# Altium project EndNodeSmall.PrjPcb
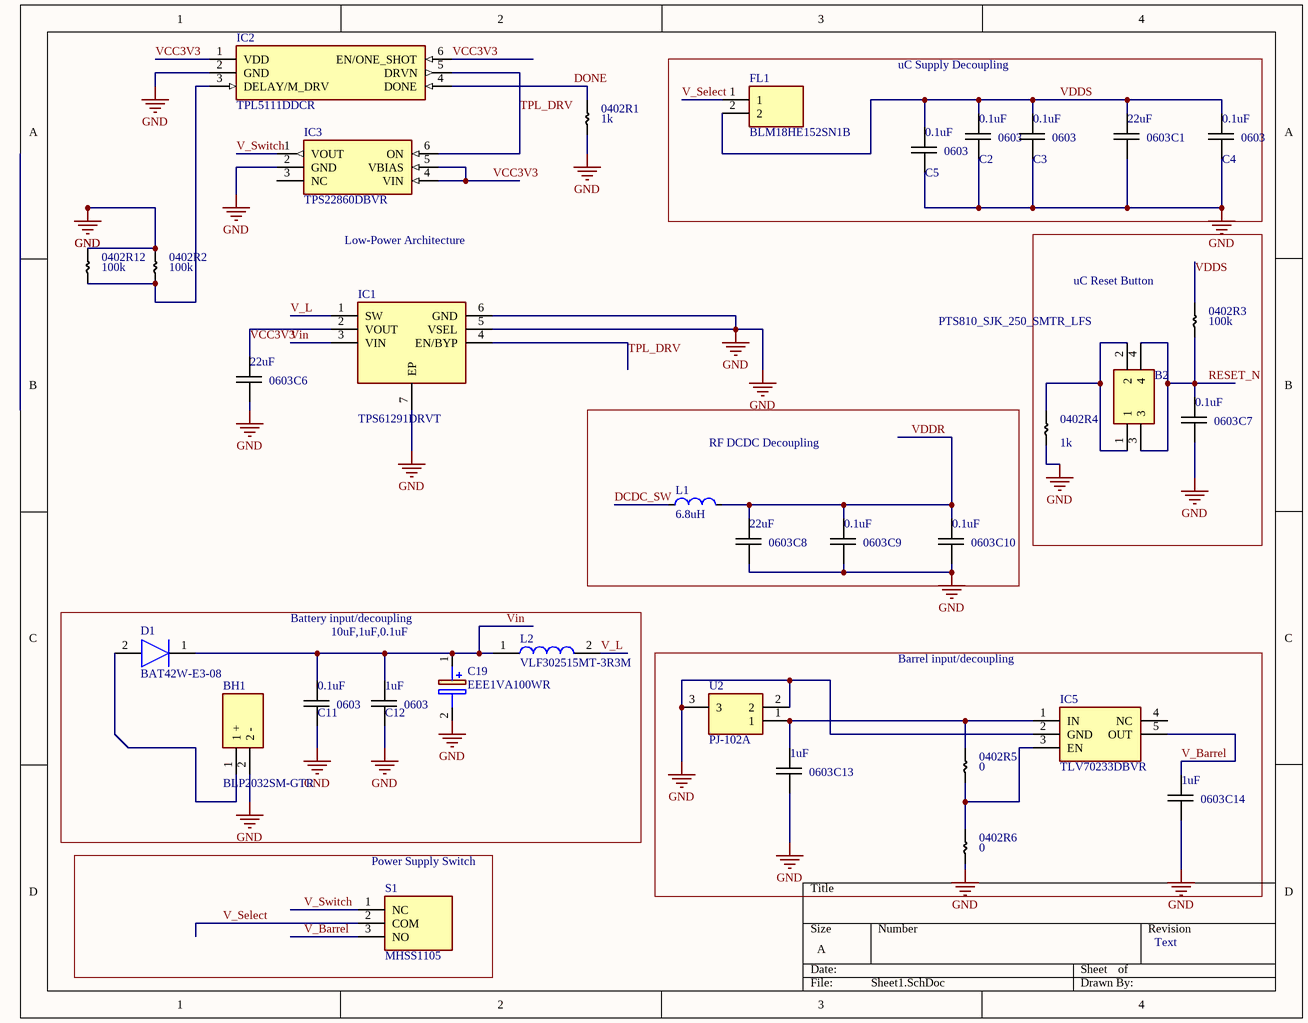
[diagram p0: Sheet1.SchDoc]
3 sheets, 54 parts. Net scope: global (net labels, ports and power ports of the same name join across sheets).
Board file: V3.PcbDoc
Sheets:
  Sheet1.SchDoc
  Sheet2.SchDoc
  Sheet3.SchDoc

## Sheet Sheet1.SchDoc
size A

### Parts
B2  PTS810_SJK_250_SMTR_LFS  [PTS810SJK250SMTRLFS]
BH1  BLP2032SM-GTR  [BLP2032SMGTR]
C1  22uF  [0603_SMD]
C2  0.1uF  [0603_SMD]
C3  0.1uF  [0603_SMD]
C4  0.1uF  [0603_SMD]
C5  0.1uF  [0603_SMD]
C6  22uF  [0603_SMD]
C7  0.1uF  [0603_SMD]
C8  22uF  [0603_SMD]
C9  0.1uF  [0603_SMD]
C10  0.1uF  [0603_SMD]
C11  0.1uF  [0603_SMD]
C12  1uF  [0603_SMD]
C13  1uF  [0603_SMD]
C14  1uF  [0603_SMD]
C19  EEE1VA100WR  [CAPAE430X550N]
D1  BAT42W-E3-08  [SOD3716X135N]
FL1  BLM18HE152SN1B  [BEADC1608X95N]
IC1  TPS61291DRVT  [SON65P200X200X80-7N]
IC2  TPL5111DDCR  [SOT95P280X110-6N]
IC3  TPS22860DBVR  [SOT95P280X145-6N]
IC5  TLV70233DBVR  [SOT95P280X145-5N]
L1  value 6.8uH  [PASSIVE-INDUCTOR-0603]  (hidden comment: Passive-Inductor (Generic))
L2  VLF302515MT-3R3M  [VLF302515MT]
R1  1k  [0402_SMD]
R2  100k  [0402_SMD]
R3  100k  [0402_SMD]
R4  1k  [0402_SMD]
R5  0  [0402_SMD]
R6  0  [0402_SMD]
R12  100k  [0402_SMD]
S1  MHSS1105  [MHSS1105]
U2  PJ-102A  [PJ-102AH]

### Blocks framed on the sheet
uC Supply Decoupling: C1-C5 FL1
uC Reset Button: B2 C7 R3 R4
RF DCDC Decoupling: C8-C10 L1
Barrel input/decoupling: C13 C14 IC5 R5 R6 U2
Power Supply Switch: S1

### Nets
GND: BH1.2(2_-) C1.1 C2.1 C3.1 C4.1 C5.1 C6.1 C7.1 C8.1 C9.1 C10.1 C11.1 C12.1 C13.1 C14.1 C19.2(-) IC1.5(VSEL) IC1.6(GND) IC1.7(EP) IC2.2(GND) IC3.2(GND) IC5.2(GND) R1.2 R2.1 R4.2 R6.2 R12.1 U2.2 U2.3
DCDC_SW: L1.1
DONE: IC2.4(DONE) R1.1
RESET_N: B2.3 B2.4 C7.2 R3.2
TPL_DRV: IC1.4(EN/BYP) IC2.5(DRVN) IC3.6(ON)
V_Barrel: C14.2 IC5.5(OUT) S1.3(NO)
V_L: IC1.1(SW) L2.2
V_Select: FL1.1 S1.2(COM)
V_Switch: IC3.1(VOUT) S1.1(NC)
VCC3V3: C6.2 IC1.2(VOUT) IC2.1(VDD) IC2.6(EN/ONE_SHOT) IC3.4(VIN) IC3.5(VBIAS)
VDDR: C8.2 C9.2 C10.2 L1.2
VDDS: C1.2 C2.2 C3.2 C4.2 C5.2 FL1.2 R3.1
Vin: C11.2 C12.2 C19.1(+) D1.1(K) IC1.3(VIN) L2.1
NetB2_1: B2.1 B2.2 R4.1
NetBH1_1: BH1.1(1_+) D1.2(A)
NetC13_2: C13.2 IC5.1(IN) R5.1 U2.1
NetIC2_3: IC2.3(DELAY/M_DRV) R2.2 R12.2
NetIC5_3: IC5.3(EN) R5.2 R6.1

Not connected (* = marked no-connect by the designer): IC3 3(NC); IC5 4(NC)

### Notes on the sheet
- Low-Power Architecture
- (near C19) Battery input/decoupling
- 10uF,1uF,0.1uF
- Text
- (in symbol C_0603) 0603
- (in symbol R_0402) 0402

### Library data of the parts
B2 = PTS810_SJK_250_SMTR_LFS: Crystal or Oscillator; Manufacturer_Name: C & K COMPONENTS; Manufacturer_Part_Number: PTS810 SJK 250 SMTR LFS; Datasheet Link: https://www.ckswitches.com/media/1476/pts810.pdf; Height: 2mm; Mouser Part Number: 611-PTS810SJK250SMTR; Mouser Price/Stock: https://www.mouser.com/Search/Refine.aspx?Keyword=611-PTS810SJK250SMTR
BH1 = BLP2032SM-GTR: Undefined or Miscellaneous; Manufacturer_Name: MPD (Memory Protection Devices); Datasheet Link: http://www.memoryprotectiondevices.com/datasheets/BLP2032SM-GTR-datasheet.pdf; Height: 4.75mm; Manufacturer_Part_Number: BLP2032SM-GTR
C1-C14 = C_0603
C19 = EEE1VA100WR: Capacitor Polarised; Manufacturer_Name: Panasonic; Datasheet Link: https://industrial.panasonic.com/cdbs/www-data/pdf/RDE0000/ABA0000C1145.pdf; Height: 5.5mm; Manufacturer_Part_Number: EEE1VA100WR; RS Part Number: 1766382; RS Price/Stock: https://uk.rs-online.com/web/p/products/1766382
D1 = BAT42W-E3-08: Diode; Manufacturer_Name: Vishay; Datasheet Link: http://www.vishay.com/docs/85661/bat42w.pdf; Height: 1.35mm; Manufacturer_Part_Number: BAT42W-E3-08; Mouser Part Number: 78-BAT42W-E3-08; Mouser Price/Stock: https://www.mouser.com/Search/Refine.aspx?Keyword=78-BAT42W-E3-08; RS Part Number: 1808601P; RS Price/Stock: http://uk.rs-online.com/web/p/products/1808601P
FL1 = BLM18HE152SN1B: Filter; Manufacturer_Name: Murata Electronics; Datasheet Link: https://www.murata.com/en-us/products/productdetail?partno=BLM18HE152SN1%23; Height: 0.95mm; Manufacturer_Part_Number: BLM18HE152SN1B; Mouser Part Number: N/A; Mouser Price/Stock: https://www.mouser.com/Search/Refine.aspx?Keyword=N%2FA
IC1 = TPS61291DRVT: Integrated Circuit; Manufacturer_Name: Texas Instruments; Datasheet Link: http://uk.rs-online.com/web/p/products/9143112P; Height: 0.8mm; Manufacturer_Part_Number: TPS61291DRVT; Mouser Part Number: 595-TPS61291DRVT; Mouser Price/Stock: https://www.mouser.com/Search/Refine.aspx?Keyword=595-TPS61291DRVT; RS Part Number: 9143112P; RS Price/Stock: http://uk.rs-online.com/web/p/products/9143112P
IC2 = TPL5111DDCR: Undefined or Miscellaneous; Manufacturer_Name: Texas Instruments; Datasheet Link: http://www.ti.com/lit/ds/symlink/tpl5111.pdf; Height: 1.1mm; Manufacturer_Part_Number: TPL5111DDCR; Mouser Part Number: 595-TPL5111DDCR; Mouser Price/Stock: https://www.mouser.com/Search/Refine.aspx?Keyword=595-TPL5111DDCR
IC3 = TPS22860DBVR: Switch; Manufacturer_Name: Texas Instruments; Datasheet Link: http://www.ti.com/lit/gpn/tps22860; Height: 1.45mm; Manufacturer_Part_Number: TPS22860DBVR; Mouser Part Number: 595-TPS22860DBVR; Mouser Price/Stock: https://www.mouser.com/Search/Refine.aspx?Keyword=595-TPS22860DBVR
IC5 = TLV70233DBVR: Integrated Circuit; Manufacturer_Name: Texas Instruments; Datasheet Link: http://www.ti.com/lit/gpn/tlv702; Height: 1.45mm; Manufacturer_Part_Number: TLV70233DBVR; Mouser Part Number: 595-TLV70233DBVR; Mouser Price/Stock: https://www.mouser.com/Search/Refine.aspx?Keyword=595-TLV70233DBVR
L1 = Passive-Inductor (Generic): Generic Inductor; Category: Passive; Manufacturer: *; Supplier 2: Digi-Key; Manufacturer Part Number: *; Supplier 1: Mouser; Package: *; Supplier Part Number 1: *; Supplier Part Number 2: *; Through Hole (y/n): *
L2 = VLF302515MT-3R3M: Inductor; Manufacturer_Name: TDK; Datasheet Link: https://product.tdk.com/info/en/documents/wdcatalog/withdrawn_inductor_commercial_power_vlf302515mt_en.pdf; Manufacturer_Part_Number: VLF302515MT-3R3M; Mouser Part Number: 810-VLF302515MT-3R3M; Mouser Price/Stock: https://www.mouser.com/Search/Refine.aspx?Keyword=810-VLF302515MT-3R3M
R1-R6 R12 = R_0402
S1 = MHSS1105: Switch; Manufacturer_Name: Apem; Datasheet Link: https://componentsearchengine.com/Datasheets/2/MHSS1105.pdf; Height: 4mm; Manufacturer_Part_Number: MHSS1105; Mouser Part Number: 642-MHSS1105; Mouser Price/Stock: https://www.mouser.com/Search/Refine.aspx?Keyword=642-MHSS1105
U2 = PJ-102A: Connector; Manufacturer_Name: CUI; Datasheet Link: https://www.cui.com/product/resource/pj-102a.pdf; Manufacturer_Part_Number: PJ-102A; Mouser Part Number: 490-PJ-102A; Mouser Price/Stock: https://www.mouser.com/Search/Refine.aspx?Keyword=490-PJ-102A

## Sheet Sheet2.SchDoc
size A
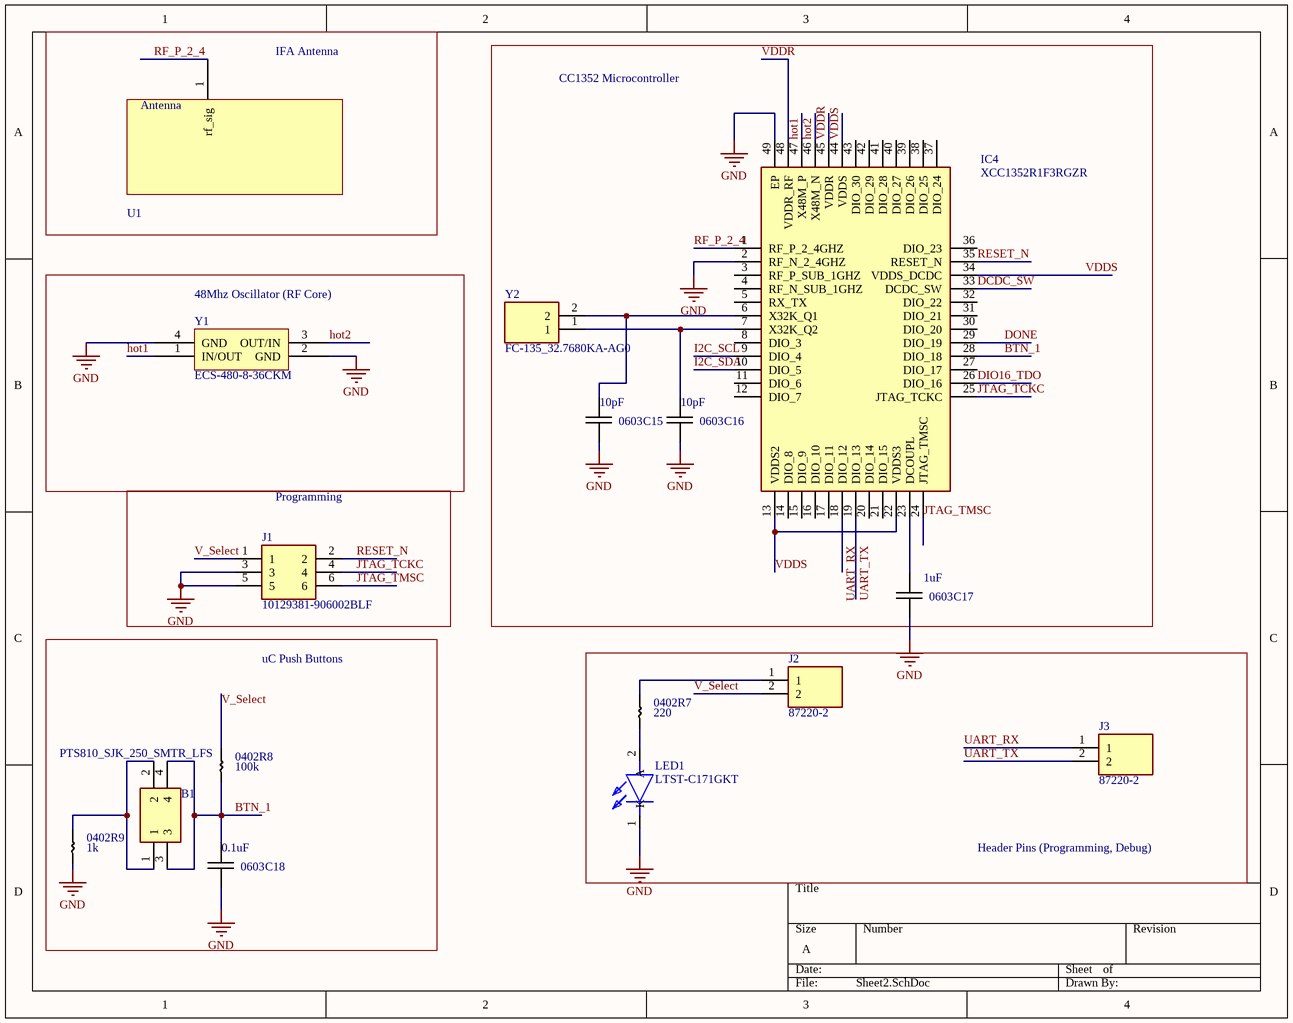
[diagram p1: Sheet2.SchDoc]

### Parts
B1  PTS810_SJK_250_SMTR_LFS  [PTS810SJK250SMTRLFS]
C15  10pF  [0603_SMD]
C16  10pF  [0603_SMD]
C17  1uF  [0603_SMD]
C18  0.1uF  [0603_SMD]
IC4  XCC1352R1F3RGZR  [QFN50P700X700X100-49N-D]
J1  10129381-906002BLF  [HDRV6W67P254_2X3_762X483X858P]
J2  87220-2  [HDRV2W67P0X254_1X2_467X234X1083P]
J3  87220-2  [HDRV2W67P0X254_1X2_467X234X1083P]
LED1  LTST-C171GKT  [LEDC2012X90N]
R7  220  [0402_SMD]
R8  100k  [0402_SMD]
R9  1k  [0402_SMD]
U1  RF_ANTENNA_2  [RF_TRACE_ANTENNA_2]  (value not drawn)
Y1  ECS-480-8-36CKM  [ECS-480-8-36CKM]
Y2  FC-135_32.7680KA-AG0  [FC135327680KAAG0]

### Blocks framed on the sheet
IFA Antenna: U1
CC1352 Microcontroller: C15-C17 IC4 Y2
48Mhz Oscillator (RF Core): Y1
Programming: J1
uC Push Buttons: B1 C18 R8 R9
Header Pins (Programming, Debug): J2 J3 LED1 R7

### Nets
GND: C15.1 C16.1 C17.1 C18.1 IC4.2(RF_N_2_4GHZ) IC4.49(EP) J1.3 J1.5 LED1.1(K) R9.2 Y1.2(GND) Y1.4(GND)
BTN_1: B1.3 B1.4 C18.2 IC4.28(DIO_18) R8.2
DCDC_SW: IC4.33(DCDC_SW)
DIO16_TDO: IC4.26(DIO_16)
DONE: IC4.29(DIO_19)
hot1: IC4.47(X48M_P) Y1.1(IN/OUT)
hot2: IC4.46(X48M_N) Y1.3(OUT/IN)
I2C_SCL: IC4.9(DIO_4)
I2C_SDA: IC4.10(DIO_5)
JTAG_TCKC: IC4.25(JTAG_TCKC) J1.4
JTAG_TMSC: IC4.24(JTAG_TMSC) J1.6
RESET_N: IC4.35(RESET_N) J1.2
RF_P_2_4: IC4.1(RF_P_2_4GHZ) U1.1(rf_sig)
UART_RX: IC4.18(DIO_12) J3.1
UART_TX: IC4.19(DIO_13) J3.2
V_Select: J1.1 J2.2 R8.1
VDDR: IC4.45(VDDR) IC4.48(VDDR_RF)
VDDS: IC4.13(VDDS2) IC4.22(VDDS3) IC4.34(VDDS_DCDC) IC4.44(VDDS)
NetB1_1: B1.1 B1.2 R9.1
NetC15_2: C15.2 IC4.6(X32K_Q1) Y2.2
NetC16_2: C16.2 IC4.7(X32K_Q2) Y2.1
NetC17_2: C17.2 IC4.23(DCOUPL)
NetJ2_1: J2.1 R7.1
NetLED1_2: LED1.2(A) R7.2

Not connected (* = marked no-connect by the designer): IC4 3(RF_P_SUB_1GHZ) 4(RF_N_SUB_1GHZ) 5(RX_TX) 8(DIO_3) 11(DIO_6) 12(DIO_7) 14(DIO_8) 15(DIO_9) 16(DIO_10) 17(DIO_11) 20(DIO_14) 21(DIO_15) 27(DIO_17) 30(DIO_20) 31(DIO_21) 32(DIO_22) 36(DIO_23) 37(DIO_24) 38(DIO_25) 39(DIO_26) 40(DIO_27) 41(DIO_28) 42(DIO_29) 43(DIO_30)

### Notes on the sheet
- (in symbol C_0603) 0603
- (in symbol R_0402) 0402
- (in symbol RF_ANTENNA_2) Antenna

### Library data of the parts
B1 = PTS810_SJK_250_SMTR_LFS: as B2 on sheet Sheet1; Datasheet Link: https://www.ckswitches.com/media/1476/pts810.pdf; Height: 2mm; Mouser Part Number: 611-PTS810SJK250SMTR; Mouser Price/Stock: https://www.mouser.com/Search/Refine.aspx?Keyword=611-PTS810SJK250SMTR
C15-C18 = C_0603
IC4 = XCC1352R1F3RGZR: Integrated Circuit; Manufacturer_Name: Texas Instruments; Datasheet Link: http://www.ti.com/lit/gpn/cc1352r; Height: 1mm; Manufacturer_Part_Number: XCC1352R1F3RGZR
J1 = 10129381-906002BLF: Connector; Manufacturer_Name: Amphenol; Datasheet Link: https://componentsearchengine.com/Datasheets/1/10129381-906002BLF.pdf; Height: 8.58mm; Manufacturer_Part_Number: 10129381-906002BLF; Mouser Part Number: 649-1012938190602BLF; Mouser Price/Stock: https://www.mouser.com/Search/Refine.aspx?Keyword=649-1012938190602BLF
J2 J3 = 87220-2: Connector; Manufacturer_Name: TE Connectivity; Allied_Number: 70082840; Datasheet Link: https://www.te.com/commerce/DocumentDelivery/DDEController?Action=showdoc&DocId=Customer+Drawing%7F87220%7FK3%7Fpdf%7FEnglish%7FENG_CD_87220_K3.pdf%7F87220-2; Height: 10.83mm; Manufacturer_Part_Number: 87220-2; Mouser Part Number: 571-872202; Mouser Price/Stock: https://www.mouser.com/Search/Refine.aspx?Keyword=571-872202; RS Part Number: 7202418P; RS Price/Stock: http://uk.rs-online.com/web/p/products/7202418P; Allied Price/Stock: https://www.alliedelec.com/teconnectivity-87220-2/70082840/
LED1 = LTST-C171GKT: LED; Manufacturer_Name: Lite-On; Datasheet Link: https://media.digikey.com/pdf/Data%20Sheets/Lite-On%20PDFs/LTST-C171GKT.pdf; Height: 0.9mm; Manufacturer_Part_Number: LTST-C171GKT; Mouser Part Number: 859-LTST-C171GKT; Mouser Price/Stock: https://www.mouser.com/Search/Refine.aspx?Keyword=859-LTST-C171GKT; RS Part Number: 6920935P; RS Price/Stock: http://uk.rs-online.com/web/p/products/6920935P
R7-R9 = R_0402
Y2 = FC-135_32.7680KA-AG0: Crystal or Oscillator; Manufacturer_Name: Epson Timing; Manufacturer_Part_Number: FC-135 32.7680KA-AG0; Datasheet Link: https://support.epson.biz/td/api/doc_check.php?dl=brief_FC-135&lang=en/.pdf; Height: 0mm; Mouser Part Number: 732-FC135-32.76KAAG0; Mouser Price/Stock: https://www.mouser.com/Search/Refine.aspx?Keyword=732-FC135-32.76KAAG0

## Sheet Sheet3.SchDoc
size A
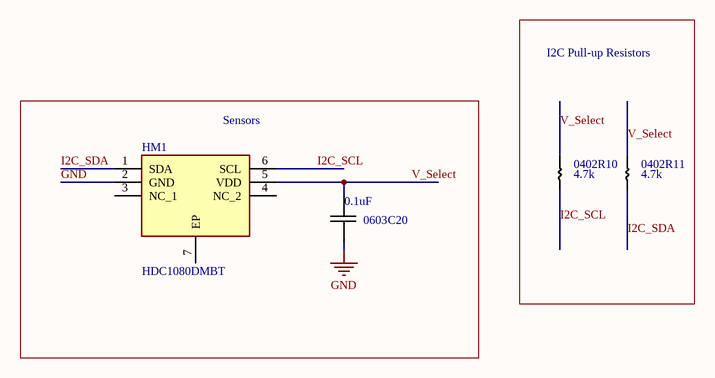
[diagram p2: Sheet3.SchDoc]

### Parts
C20  0.1uF  [0603_SMD]
HM1  HDC1080DMBT  [SON100P300X300X80-7N]
R10  4.7k  [0402_SMD]
R11  4.7k  [0402_SMD]

### Blocks framed on the sheet
I2C Pull-up Resistors: R10 R11
Sensors: C20 HM1

### Nets
GND: C20.1 HM1.2(GND)
I2C_SCL: HM1.6(SCL) R10.2
I2C_SDA: HM1.1(SDA) R11.2
V_Select: C20.2 HM1.5(VDD) R10.1 R11.1

Not connected (* = marked no-connect by the designer): HM1 3(NC_1) 4(NC_2) 7(EP)

### Notes on the sheet
- (in symbol C_0603) 0603
- (in symbol R_0402) 0402

### Library data of the parts
C20 = C_0603
HM1 = HDC1080DMBT: Hygrometer; Manufacturer_Name: Texas Instruments; Datasheet Link: http://www.mouser.com/ds/2/405/hdc1080-844688.pdf; Height: 0.8mm; Manufacturer_Part_Number: HDC1080DMBT; Mouser Part Number: 595-HDC1080DMBT; Mouser Price/Stock: https://www.mouser.com/Search/Refine.aspx?Keyword=595-HDC1080DMBT; RS Part Number: 1330170P; RS Price/Stock: http://uk.rs-online.com/web/p/products/1330170P
R10 R11 = R_0402

## Nets that join several sheets
GND: Sheet1 (29 pins), Sheet2 (12 pins), Sheet3 (C20.1 HM1.2)
DCDC_SW: Sheet1 (L1.1), Sheet2 (IC4.33)
DONE: Sheet1 (IC2.4 R1.1), Sheet2 (IC4.29)
I2C_SCL: Sheet2 (IC4.9), Sheet3 (HM1.6 R10.2)
I2C_SDA: Sheet2 (IC4.10), Sheet3 (HM1.1 R11.2)
RESET_N: Sheet1 (B2.3 B2.4 C7.2 R3.2), Sheet2 (IC4.35 J1.2)
V_Select: Sheet1 (FL1.1 S1.2), Sheet2 (J1.1 J2.2 R8.1), Sheet3 (C20.2 HM1.5 R10.1 R11.1)
VDDR: Sheet1 (C8.2 C9.2 C10.2 L1.2), Sheet2 (IC4.45 IC4.48)
VDDS: Sheet1 (7 pins), Sheet2 (IC4.13 IC4.22 IC4.34 IC4.44)